# EAGLE schematic EEPROM_Modul (EAGLE 9.6.2)
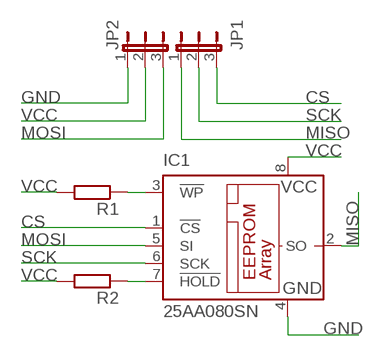
[diagram p0: schematic, sheet 1]

## Parts
IC1  25AA080SN  [SO-08]
JP1  JP2E  [JP2]
JP2  JP2E  [JP2]
R1  R-EU_R0805  [R0805]
R2  R-EU_R0805  [R0805]

## Nets
CS: IC1.1(!CS) JP1.3
GND: IC1.4(GND) JP2.1
MISO: IC1.2(SO) JP1.1
MOSI: IC1.5(SI) JP2.3
N$1: IC1.3(!WP) R1.1
N$2: IC1.7(!HOLD) R2.1
SCK: IC1.6(SCK) JP1.2
VCC: IC1.8(VCC) JP2.2 R1.2 R2.2

## Library data of the parts
IC1 = microchip:25*: Serial EEPROM 4K/ 8K , SPI bus; MF: MICROCHIP; MPN: 25AA080/SN; OC_FARNELL: 1816072; OC_NEWARK: 92C7351
JP1 JP2 = jumper:JP2E: JUMPER
R1 R2 = rcl:R-EU_: RESISTOR, European symbol; SPICEPREFIX: R